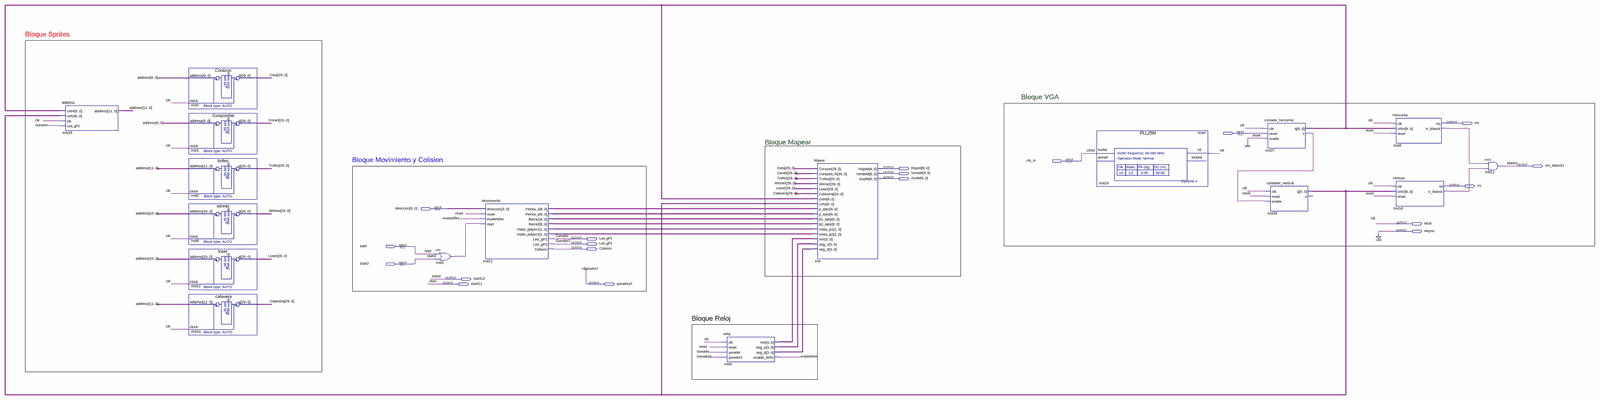
[diagram p0: schematic sheet, whole]
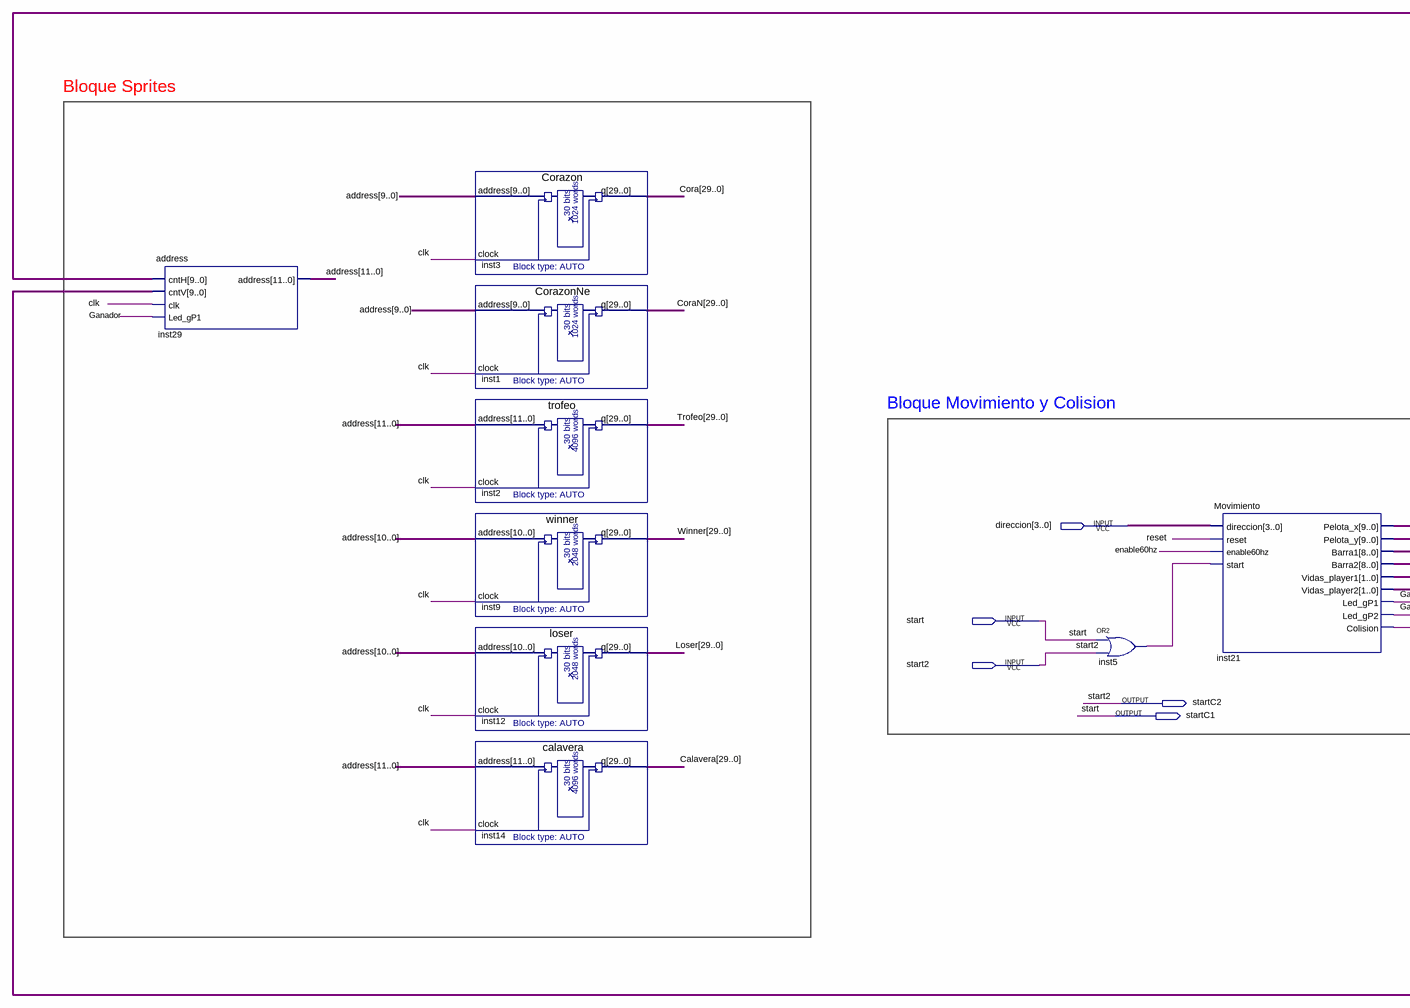
[diagram p1: schematic sheet, left part]
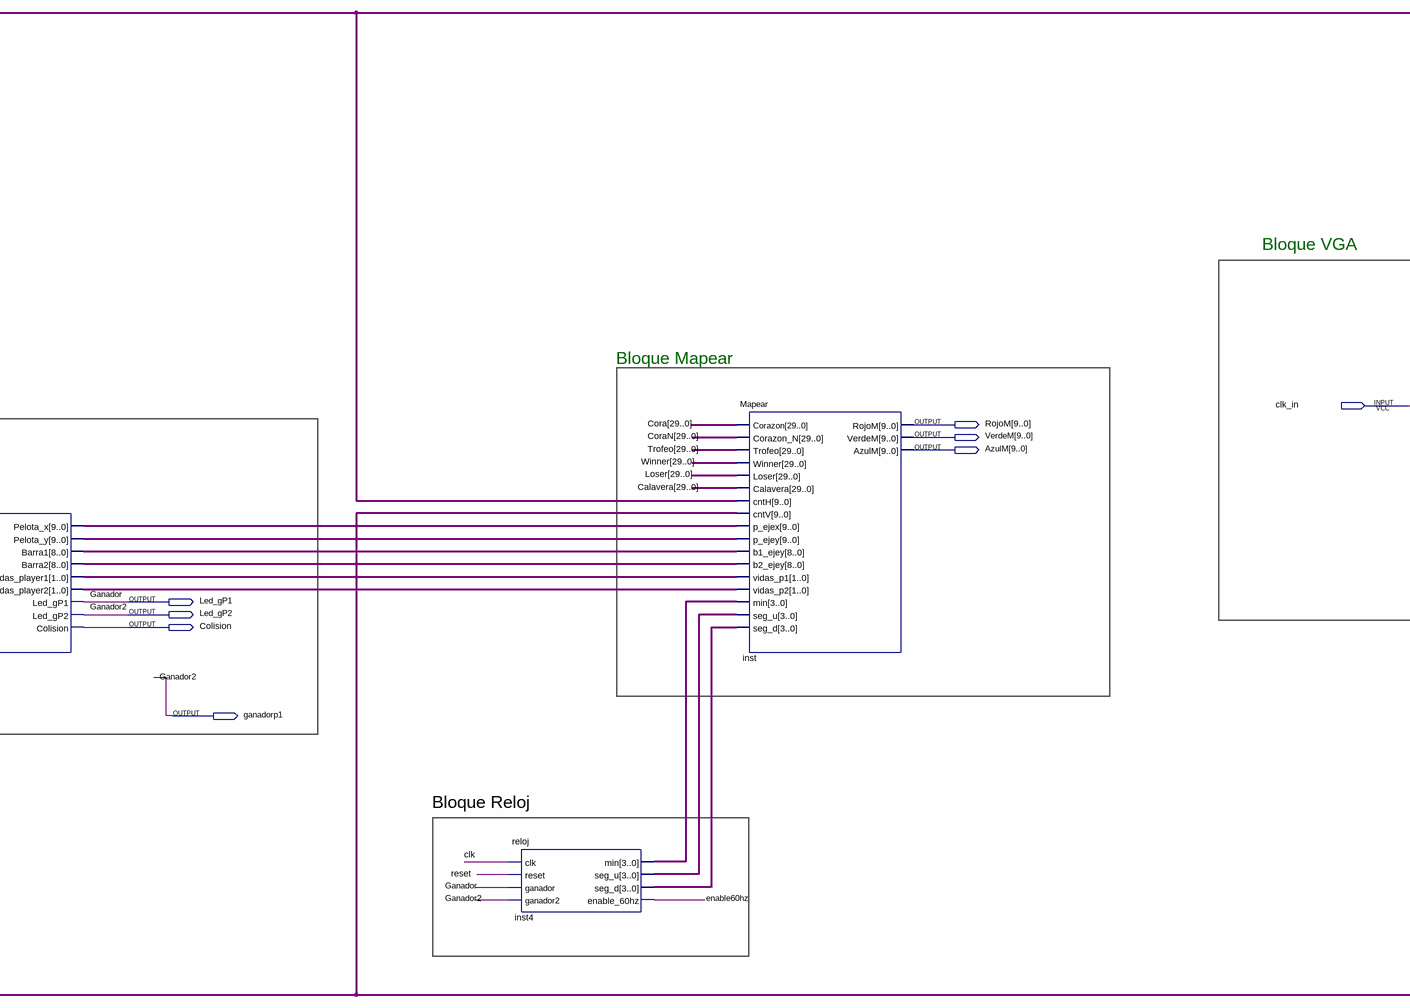
[diagram p2: schematic sheet, centre part]
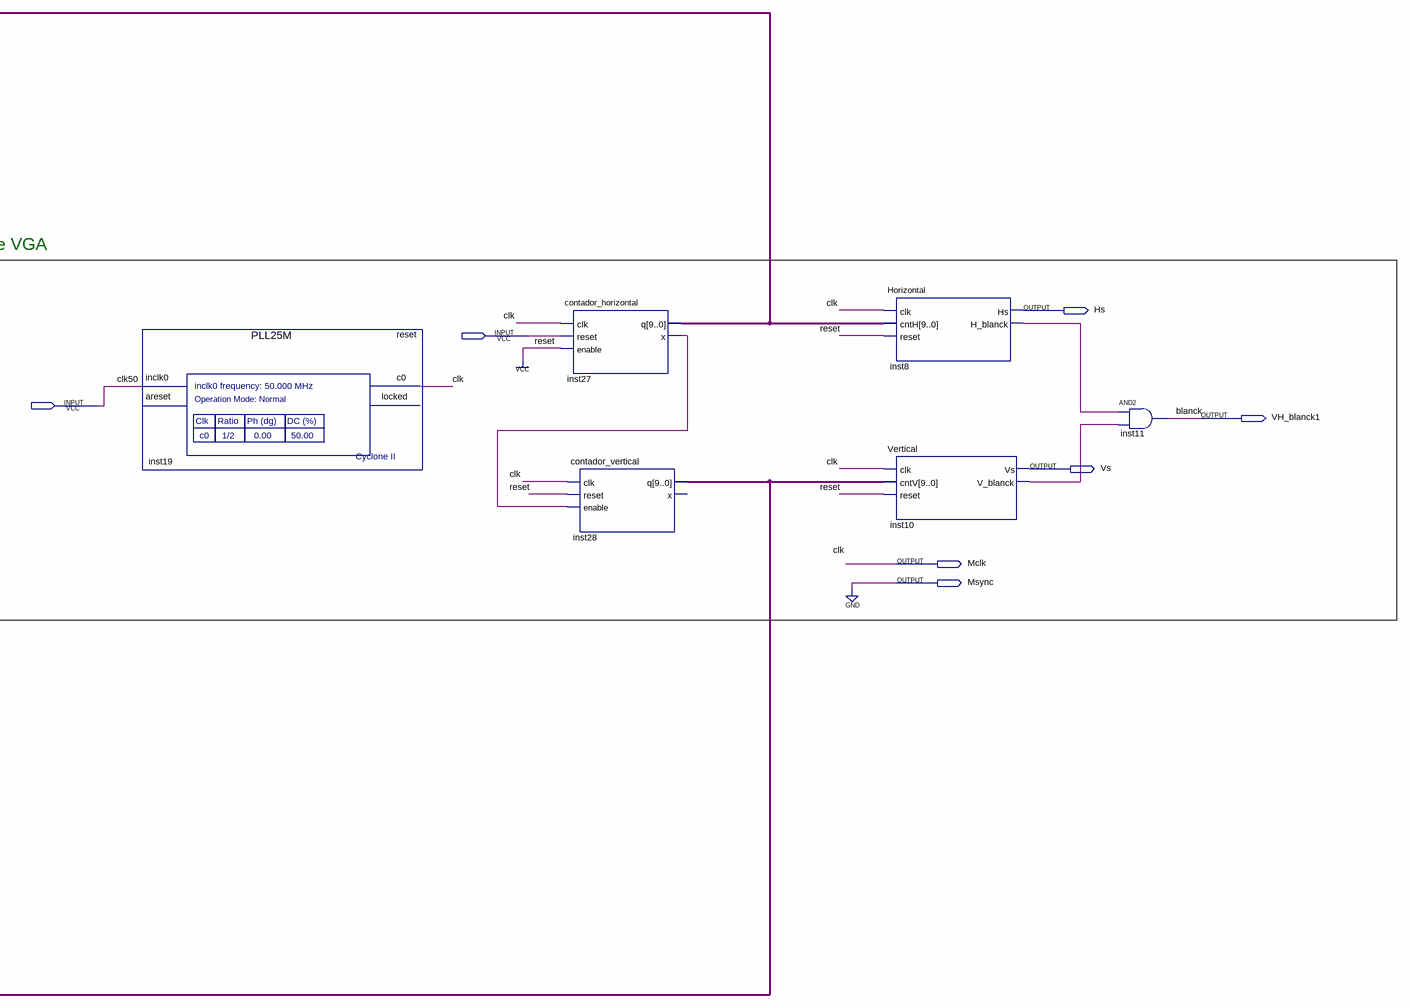
[diagram p3: schematic sheet, right part]
// Quartus schematic Pong.bdf as structural Verilog: 17 symbols, 19 pins
module Pong (
  input  reset,
  input  clk_in,
  input  [3:0] direccion,
  input  start,
  input  start2,
  output Hs,
  output VH_blanck1,
  output [9:0] RojoM,
  output [9:0] VerdeM,
  output [9:0] AzulM,
  output Vs,
  output Mclk,
  output Msync,
  output Led_gP1,
  output Led_gP2,
  output Colision,
  output startC2,
  output startC1,
  output ganadorp1
);

  wire enable60hz, inst5_out, inst8_h_blanck, inst10_v_blanck, inst27_x;
  wire [1:0] inst21_vidas_player1, inst21_vidas_player2;
  wire [3:0] inst4_min, inst4_seg_d, inst4_seg_u;
  wire [8:0] inst21_barra1, inst21_barra2;
  wire [9:0] inst21_pelota_x, inst21_pelota_y, inst27_q, inst28_q;
  wire [11:0] address;
  wire [29:0] Calavera, Cora, CoraN, Loser, Trofeo, Winner;

  address inst29 (.cntH(inst27_q), .cntV(inst28_q), .clk(Mclk), .Led_gP1(Led_gP1), .address(address));
  Corazon inst3 (.address(address[9:0]), .clock(Mclk), .q(Cora));
  CorazonNe inst1 (.address(address[9:0]), .clock(Mclk), .q(CoraN));
  trofeo inst2 (.address(address), .clock(Mclk), .q(Trofeo));
  winner inst9 (.address(address[10:0]), .clock(Mclk), .q(Winner));
  loser inst12 (.address(address[10:0]), .clock(Mclk), .q(Loser));
  calavera inst14 (.address(address), .clock(Mclk), .q(Calavera));
  or inst5 (inst5_out, start, start2);
  Movimiento inst21 (
    .direccion(direccion), .reset(reset), .enable60hz(enable60hz), .start(inst5_out),
    .Pelota_x(inst21_pelota_x), .Pelota_y(inst21_pelota_y), .Barra1(inst21_barra1), .Barra2(inst21_barra2),
    .Vidas_player1(inst21_vidas_player1), .Vidas_player2(inst21_vidas_player2), .Led_gP1(Led_gP1),
    .Led_gP2(ganadorp1), .Colision(Colision));
  reloj inst4 (
    .clk(Mclk), .reset(reset), .ganador(Led_gP1), .ganador2(ganadorp1), .min(inst4_min), .seg_u(inst4_seg_u),
    .seg_d(inst4_seg_d), .enable_60hz(enable60hz));
  Mapear inst (
    .Corazon(Cora), .Corazon_N(CoraN), .Trofeo(Trofeo), .Winner(Winner), .Loser(Loser), .Calavera(Calavera),
    .cntH(inst27_q), .cntV(inst28_q), .p_ejex(inst21_pelota_x), .p_ejey(inst21_pelota_y),
    .b1_ejey(inst21_barra1), .b2_ejey(inst21_barra2), .vidas_p1(inst21_vidas_player1),
    .vidas_p2(inst21_vidas_player2), .min(inst4_min), .seg_u(inst4_seg_u), .seg_d(inst4_seg_d),
    .RojoM(RojoM), .VerdeM(VerdeM), .AzulM(AzulM));
  PLL25M inst19 (.inclk0(clk_in), .c0(Mclk));  // open: areset, locked
  contador_horizontal inst27 (.clk(Mclk), .reset(reset), .enable(1'b1), .q(inst27_q), .x(inst27_x));
  contador_vertical inst28 (.clk(Mclk), .reset(reset), .enable(inst27_x), .q(inst28_q));  // open: x
  Horizontal inst8 (.clk(Mclk), .cntH(inst27_q), .reset(reset), .Hs(Hs), .H_blanck(inst8_h_blanck));
  Vertical inst10 (.clk(Mclk), .cntV(inst28_q), .reset(reset), .Vs(Vs), .V_blanck(inst10_v_blanck));
  and inst11 (VH_blanck1, inst8_h_blanck, inst10_v_blanck);

  assign Led_gP2 = ganadorp1;
  assign Msync = 1'b0;
  assign startC1 = start;
  assign startC2 = start2;

  // Other names for the same wires on the sheet: blanck = VH_blanck1; clk = Mclk; clk50 = clk_in; Ganador = Led_gP1;
  //   Ganador2 = ganadorp1

  // Notes on the sheet:
  //   Bloque Sprites
  //   Bloque VGA
  //   Bloque Mapear
  //   Bloque Movimiento y Colision
  //   Bloque Reloj
endmodule
